# EAGLE design untitled (EAGLE 8.4.3)
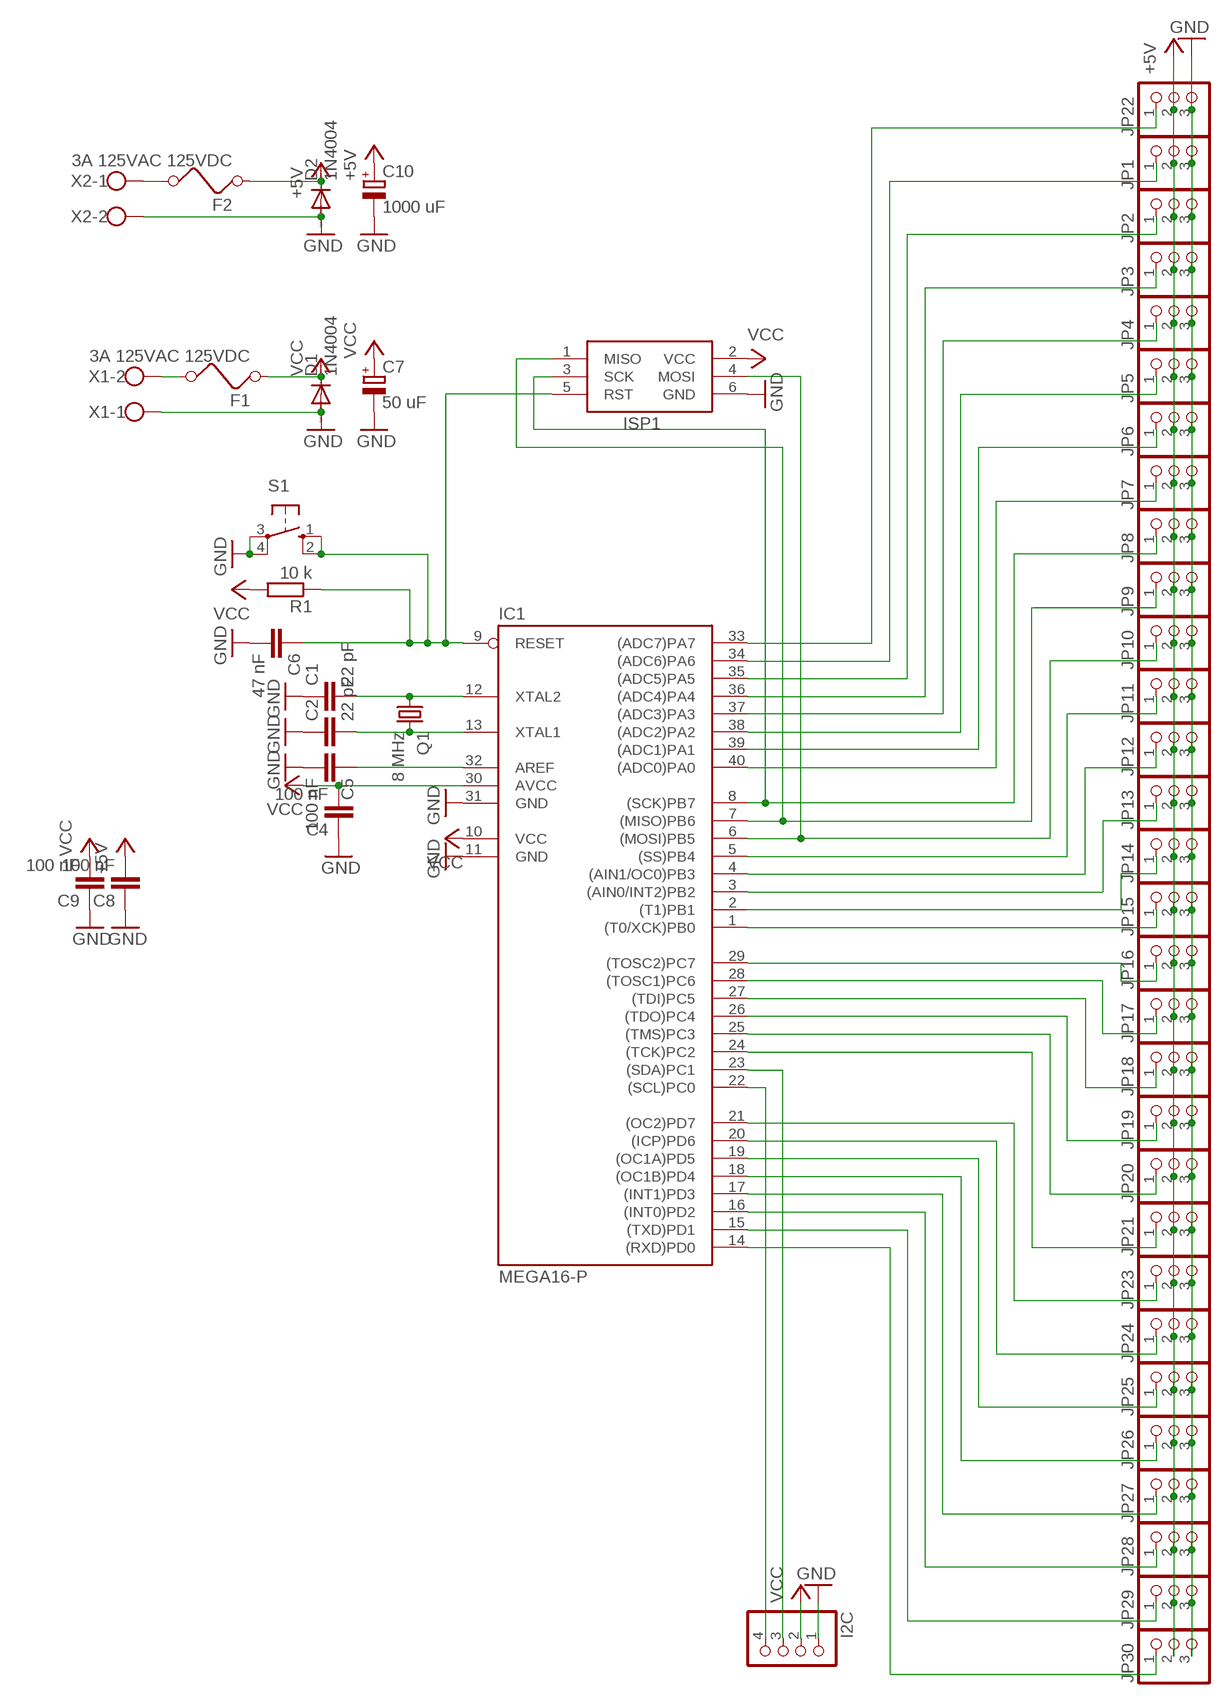
[diagram p0: schematic, sheet 1]

## Parts
C1  22 pF  C-EUC0805  [C0805]
C2  22 pF  C-EUC0805  [C0805]
C4  100 nF  C-EUC0805  [C0805]
C5  100 nF  C-EUC0805  [C0805]
C6  47 nF  C-EUC0805  [C0805]
C7  50 uF  CPOL-EUE2-5  [E2-5]
C8  100 nF  C-EUC0805  [C0805]
C9  100 nF  C-EUC0805  [C0805]
C10  1000 uF  CPOL-EUE2-5  [E2-5]
D1  1N4004  DIODE-DO214AC  [DO214AC]
D2  1N4004  DIODE-DO214AC  [DO214AC]
F1  3A 125VAC 125VDC  FUSE  [FUSE]
F2  3A 125VAC 125VDC  FUSE  [FUSE]
I2C  PINHD-1X4  [1X04]
IC1  MEGA16-P  [DIL40]
ISP1  AVRISP-6  [AVRISP]
JP1  PINHD-1X3  [1X03]
JP2  PINHD-1X3  [1X03]
JP3  PINHD-1X3  [1X03]
JP4  PINHD-1X3  [1X03]
JP5  PINHD-1X3  [1X03]
JP6  PINHD-1X3  [1X03]
JP7  PINHD-1X3  [1X03]
JP8  PINHD-1X3  [1X03]
JP9  PINHD-1X3  [1X03]
JP10  PINHD-1X3  [1X03]
JP11  PINHD-1X3  [1X03]
JP12  PINHD-1X3  [1X03]
JP13  PINHD-1X3  [1X03]
JP14  PINHD-1X3  [1X03]
JP15  PINHD-1X3  [1X03]
JP16  PINHD-1X3  [1X03]
JP17  PINHD-1X3  [1X03]
JP18  PINHD-1X3  [1X03]
JP19  PINHD-1X3  [1X03]
JP20  PINHD-1X3  [1X03]
JP21  PINHD-1X3  [1X03]
JP22  PINHD-1X3  [1X03]
JP23  PINHD-1X3  [1X03]
JP24  PINHD-1X3  [1X03]
JP25  PINHD-1X3  [1X03]
JP26  PINHD-1X3  [1X03]
JP27  PINHD-1X3  [1X03]
JP28  PINHD-1X3  [1X03]
JP29  PINHD-1X3  [1X03]
JP30  PINHD-1X3  [1X03]
Q1  8 MHz  CRYSTALHC49S  [HC49/S]
R1  10 k  R-EU_R0805  [R0805]
S1  10-XX  [B3F-10XX]
X1  W237-102  [W237-102]
X2  W237-102  [W237-102]

## Nets
+5V: C8.2 C10.+ D2.C F2.1 JP1.2 JP2.2 JP3.2 JP4.2 JP5.2 JP6.2 JP7.2 JP8.2 JP9.2 JP10.2 JP11.2 JP12.2 JP13.2 JP14.2 JP15.2 JP16.2 JP17.2 JP18.2 JP19.2 JP20.2 JP21.2 JP22.2 JP23.2 JP24.2 JP25.2 JP26.2 JP27.2 JP28.2 JP29.2 JP30.2
GND: C1.1 C2.1 C4.1 C5.2 C6.2 C7.- C8.1 C9.1 C10.- D1.A D2.A I2C.1 IC1.11(GND) IC1.31(GND) ISP1.6(GND) JP1.3 JP2.3 JP3.3 JP4.3 JP5.3 JP6.3 JP7.3 JP8.3 JP9.3 JP10.3 JP11.3 JP12.3 JP13.3 JP14.3 JP15.3 JP16.3 JP17.3 JP18.3 JP19.3 JP20.3 JP21.3 JP22.3 JP23.3 JP24.3 JP25.3 JP26.3 JP27.3 JP28.3 JP29.3 JP30.3 S1.3(P) S1.4(P1) X1.1 X2.2
N$1: C1.2 IC1.12(XTAL2) Q1.1
N$2: C2.2 IC1.13(XTAL1) Q1.2
N$3: C5.1 IC1.32(AREF)
N$4: F1.2 X1.2
N$5: IC1.8((SCK)PB7) ISP1.3(SCK) JP8.1
N$6: IC1.6((MOSI)PB5) ISP1.4(MOSI) JP10.1
N$7: C6.1 IC1.9(RESET) ISP1.5(RST) R1.1 S1.1(S) S1.2(S1)
N$8: IC1.1((T0/XCK)PB0) JP15.1
N$9: I2C.4 IC1.22((SCL)PC0)
N$10: F2.2 X2.1
N$13: IC1.36((ADC4)PA4) JP3.1
N$15: IC1.33((ADC7)PA7) JP22.1
N$16: IC1.39((ADC1)PA1) JP6.1
N$17: I2C.3 IC1.23((SDA)PC1)
N$21: IC1.28((TOSC1)PC6) JP17.1
N$22: IC1.7((MISO)PB6) ISP1.1(MISO) JP9.1
N$23: IC1.27((TDI)PC5) JP18.1
N$24: IC1.40((ADC0)PA0) JP7.1
N$25: IC1.4((AIN1/OC0)PB3) JP12.1
N$27: IC1.29((TOSC2)PC7) JP16.1
N$29: IC1.2((T1)PB1) JP14.1
N$30: IC1.3((AIN0/INT2)PB2) JP13.1
N$31: IC1.37((ADC3)PA3) JP4.1
N$32: IC1.5((SS)PB4) JP11.1
N$36: IC1.38((ADC2)PA2) JP5.1
N$39: IC1.35((ADC5)PA5) JP2.1
N$40: IC1.34((ADC6)PA6) JP1.1
N$41: IC1.26((TDO)PC4) JP19.1
N$42: IC1.25((TMS)PC3) JP20.1
N$43: IC1.24((TCK)PC2) JP21.1
N$44: IC1.21((OC2)PD7) JP23.1
N$45: IC1.20((ICP)PD6) JP24.1
N$46: IC1.19((OC1A)PD5) JP25.1
N$47: IC1.18((OC1B)PD4) JP26.1
N$48: IC1.17((INT1)PD3) JP27.1
N$49: IC1.16((INT0)PD2) JP28.1
N$56: IC1.15((TXD)PD1) JP29.1
N$57: IC1.14((RXD)PD0) JP30.1
VCC: C4.2 C7.+ C9.2 D1.C F1.1 I2C.2 IC1.10(VCC) IC1.30(AVCC) ISP1.2(VCC) R1.2

## Library data of the parts
C1 C2 C4-C6 C8 C9 = rcl:C-EU: CAPACITOR, European symbol
C7 C10 = rcl:CPOL-EU: POLARIZED CAPACITOR, European symbol
D1 D2 = diode:DIODE-: DIODE
F1 F2 = special:FUSE: FUSE 5 x 20 mm
I2C = pinhead:PINHD-1X4: PIN HEADER
IC1 = atmel:MEGA16-P: MICROCONTROLLER 16 Kbytes FLASH 1 kbytes SRAM 512 bytes EEPROM USART 8-channel 10 bit ADC Source: avr.lbr; MPN: ATMEGA16-16PU; OC_FARNELL: 9171142; OC_NEWARK: 01M6885
ISP1 = adafruit:AVRISP: AVR ISP HEADER Standard 6 pin header for AVR programming
JP1-JP30 = pinhead:PINHD-1X3: PIN HEADER
Q1 = adafruit:CRYSTAL: CRYSTAL; OC_FARNELL: 1667008; OC_NEWARK: unknown
R1 = rcl:R-EU_: RESISTOR, European symbol
S1 = switch-omron:10-XX: OMRON SWITCH; MPN: B3F-1000; OC_FARNELL: 176432; OC_NEWARK: 36M3542
X1 X2 = con-wago-500:W237-102: WAGO SCREW CLAMP; MPN: 237-102; OC_FARNELL: unknown; OC_NEWARK: 70K9898

## Board
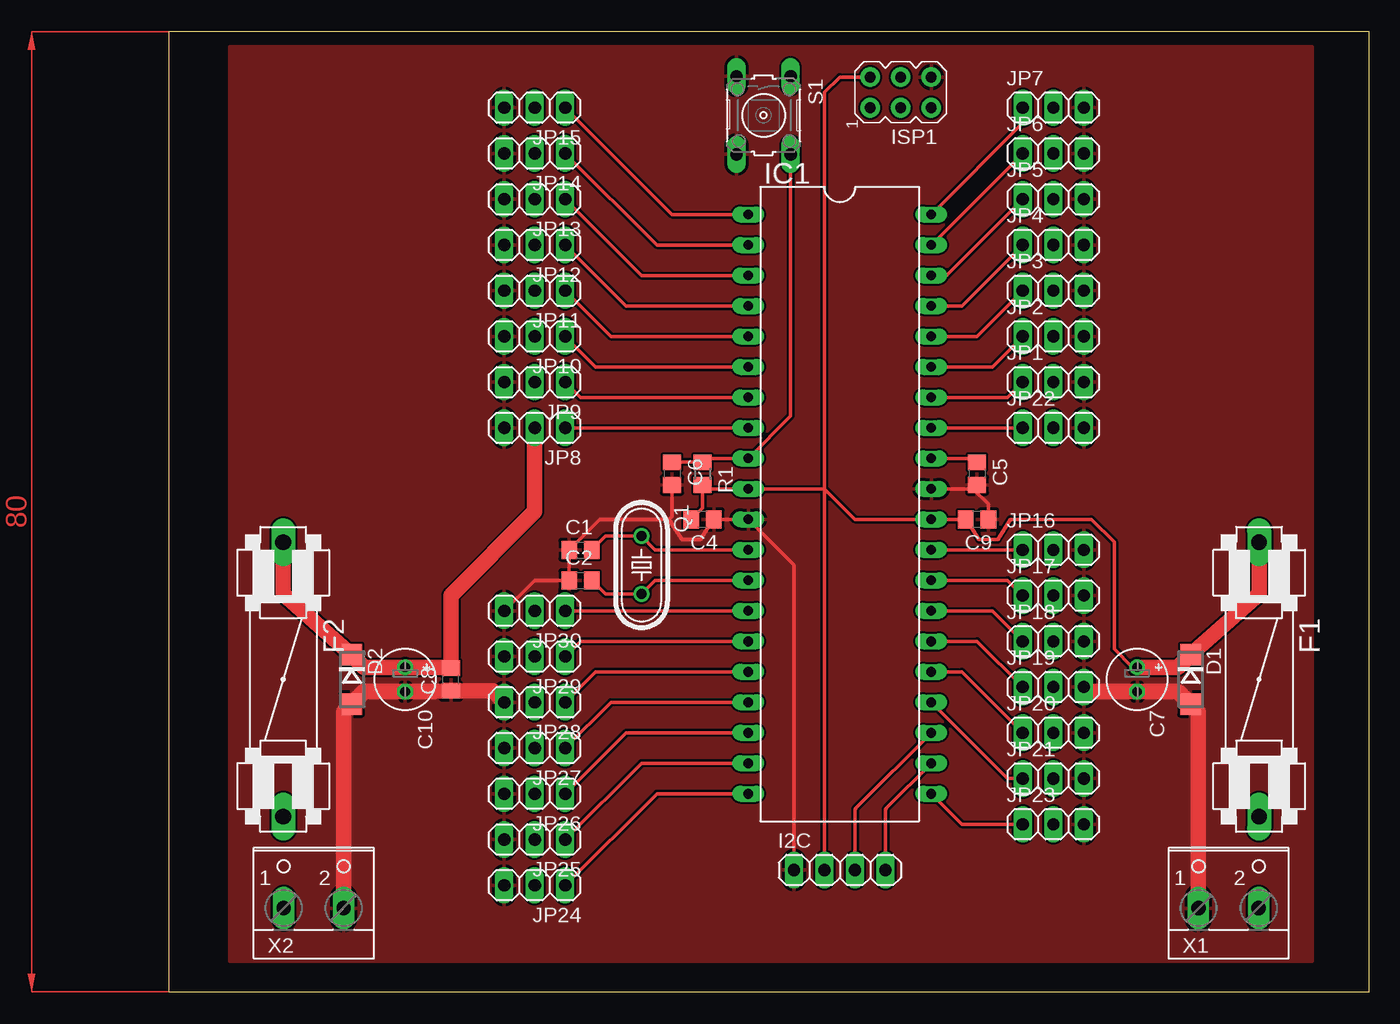
[diagram p1: board, top side]
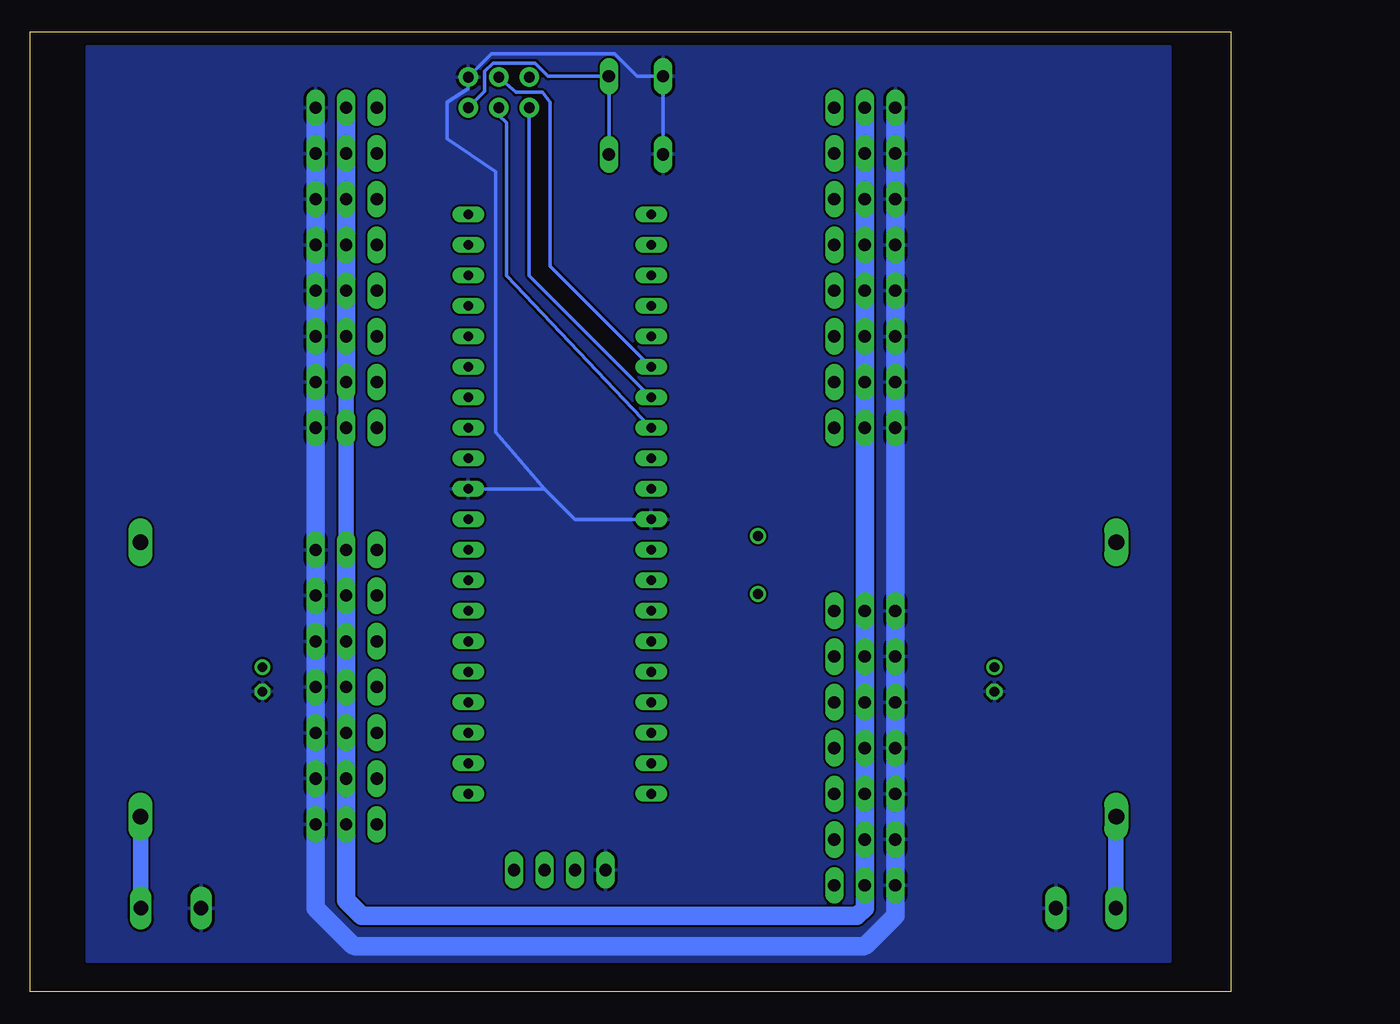
[diagram p2: board, bottom side, seen from below]

Size 100 x 80 mm. Coordinates in mm from the lower left corner, seen from the top.
Outline: 0,0 100,0 100,80 0,80 0,0
Copper layers (1*16): Top 0.035mm / dielectric 1.5mm / Bottom 0.035mm
Design rules "default *": minimum track width 12mil, minimum drill 0.3mm, track to track 7mil, track to pad 7mil, pad to pad 7mil, via to via 7mil, smd to smd 7mil, copper to edge 40mil, drill to drill 6mil, minimum pad ring 10mil, minimum via ring 8mil, stop-mask expansion 4mil, vias tented up to drill 0mil, thermal gap 10mil

### Footprints (pad centres in the part's own frame; a part is rotated, then mirrored left to right if it is on the bottom)
C0805 = smd 1.3 x 1.5: 1 -0.95,0; 2 0.95,0
E2-5 = drill 0.813 pad 1.27: + -1.016,0 | drill 0.813 pad 1.27 octagon: - 1.016,0
DO214AC = smd 1.8 x 1.7: A 2.05,0; C -2.05,0
FUSE = drill 1.321 long: 1 -11.43,0; 2 11.43,0
1X04 = drill 1.016 long: 1 -3.81,0; 2 -1.27,0; 3 1.27,0; 4 3.81,0
DIL40 = drill 0.813 long: 1 -24.13,-7.62; 2 -21.59,-7.62; 3 -19.05,-7.62; 4 -16.51,-7.62; 5 -13.97,-7.62; 6 -11.43,-7.62; 7 -8.89,-7.62; 8 -6.35,-7.62; 9 -3.81,-7.62; 10 -1.27,-7.62; 11 1.27,-7.62; 12 3.81,-7.62; 13 6.35,-7.62; 14 8.89,-7.62; 15 11.43,-7.62; 16 13.97,-7.62; 17 16.51,-7.62; 18 19.05,-7.62; 19 21.59,-7.62; 20 24.13,-7.62; 21 24.13,7.62; 22 21.59,7.62; 23 19.05,7.62; 24 16.51,7.62; 25 13.97,7.62; 26 11.43,7.62; 27 8.89,7.62; 28 6.35,7.62; 29 3.81,7.62; 30 1.27,7.62; 31 -1.27,7.62; 32 -3.81,7.62; 33 -6.35,7.62; 34 -8.89,7.62; 35 -11.43,7.62; 36 -13.97,7.62; 37 -16.51,7.62; 38 -19.05,7.62; 39 -21.59,7.62; 40 -24.13,7.62
AVRISP = drill 0.9 pad 1.626: 1 -1.27,2.54; 2 1.27,2.54; 3 -1.27,0; 4 1.27,0; 5 -1.27,-2.54; 6 1.27,-2.54
1X03 = drill 1.016 long: 1 -2.54,0; 2 0,0; 3 2.54,0
HC49/S = drill 0.813: 1 -2.413,0; 2 2.413,0
R0805 = smd 1.3 x 1.5: 1 -0.95,0; 2 0.95,0
B3F-10XX = drill 1.016 long: 1 -3.251,2.261; 2 3.251,2.261; 3 -3.251,-2.261; 4 3.251,-2.261
W237-102 = drill 1.194 long: 1 -2.5,-1.27; 2 2.5,-1.27

### Placement (x,y rotation side)
C1  34.29,36.83 0 top
C2  34.29,34.29 0 top
C4  44.45,39.37 180 top
C5  67.31,43.18 270 top
C6  41.91,43.18 270 top
C7  80.64,26.04 270 top
C8  23.5,26.04 90 top
C9  67.31,39.37 180 top
C10  19.68,26.04 270 top
D1  85.09,26.04 270 top
D2  15.24,26.04 270 top
F1  90.81,26.04 270 top
F2  9.53,26.04 270 top
I2C  55.88,10.16 0 top
IC1  55.88,40.64 270 top
ISP1  60.96,74.93 90 top
JP1  73.66,50.8 0 top
JP2  73.66,54.61 0 top
JP3  73.66,58.42 0 top
JP4  73.66,62.23 0 top
JP5  73.66,66.04 0 top
JP6  73.66,69.85 0 top
JP7  73.66,73.66 0 top
JP8  30.48,46.99 180 top
JP9  30.48,50.8 180 top
JP10  30.48,54.61 180 top
JP11  30.48,58.42 180 top
JP12  30.48,62.23 180 top
JP13  30.48,66.04 180 top
JP14  30.48,69.85 180 top
JP15  30.48,73.66 180 top
JP16  73.66,36.83 0 top
JP17  73.66,33.02 0 top
JP18  73.66,29.21 0 top
JP19  73.66,25.4 0 top
JP20  73.66,21.59 0 top
JP21  73.66,17.78 0 top
JP22  73.66,46.99 0 top
JP23  73.66,13.97 0 top
JP24  30.48,8.89 180 top
JP25  30.48,12.7 180 top
JP26  30.48,16.51 180 top
JP27  30.48,20.32 180 top
JP28  30.48,24.13 180 top
JP29  30.48,27.94 180 top
JP30  30.48,31.75 180 top
Q1  39.37,35.56 270 top
R1  44.45,43.18 270 top
S1  49.53,73.03 270 top
X1  88.27,8.26 0 top
X2  12.06,8.26 0 top

### Tracks (layer width: path | path; a pad name or v marks a point on that pad's centre or on a via)
+5V
  Top 1.27: F2.1 9.53,33.16 D2.C 16.27,27.05 C10.+ 22.79,27.05 C8.2 23.5,33.02 30.48,40.01 JP8.2
  Bottom 1.27: JP1.2 JP22.2 JP16.2
  Bottom 1.524: JP7.2 JP6.2 JP5.2 JP4.2 JP3.2 JP2.2 JP1.2 | JP16.2 JP17.2 JP18.2 JP19.2 JP20.2 JP21.2 JP23.2 73.66,7.62 72.39,6.35 31.11,6.35 30.48,6.99 JP24.2 JP25.2 JP26.2 JP27.2 JP28.2 JP29.2 JP30.2 JP8.2 JP9.2 JP10.2 JP11.2 JP12.2 JP13.2 JP14.2 JP15.2
GND
  Top 0.305: IC1.31 66.99,41.91 | 66.99,41.91 C5.2 | 41.67,39.37 35.88,39.37 C1.1 C2.1 30.61,34.29 arc45 30.39,34.2 JP30.3 | 41.67,39.37 42.72,37.68 44.28,37.68 45.33,39.37 C4.1 IC1.11 52.07,35.56 I2C.1 | C6.2 41.91,39.61 41.67,39.37 | 66.99,41.91 68.26,40.64 C9.1
  Top 1.27: JP28.3 26.99,25.09 C8.1 22.16,25.02 C10.- 16.27,25.02 D2.A 14.56,23.31 X2.2 | X1.1 85.77,23.31 D1.A 84.06,25.02 C7.- 76.58,25.02 JP19.3
  Bottom 0.305: S1.4 S1.3 49.45,76.28 51.33,78.16 61.54,78.16 ISP1.6 63.5,75.24 65.25,74.12 65.25,71.09 61.24,68.34 61.24,46.63 57.15,41.91 | IC1.11 54.61,39.37 57.15,41.91 | 57.15,41.91 IC1.31
  Bottom 1.27: 30.39,3.9 arc45 30.61,3.81 | 72.9,3.81 arc45 73.11,3.9
  Bottom 1.524: JP7.3 JP6.3 JP5.3 JP4.3 JP3.3 JP2.3 JP1.3 JP22.3 JP16.3 JP17.3 JP18.3 JP19.3 JP20.3 JP21.3 JP23.3 76.2,6.99 73.11,3.9 | JP15.3 JP14.3 JP13.3 JP12.3 JP11.3 JP10.3 JP9.3 JP8.3 JP30.3 JP29.3 JP28.3 JP27.3 JP26.3 JP25.3 JP24.3 27.94,6.35 30.39,3.9 | 30.61,3.81 72.9,3.81
  pour Top: 6.35,2.54 95.25,2.54 95.25,78.74 5.08,78.74 5.08,2.54
  pour Bottom: 5.08,78.74 5.08,2.54 95.25,2.54 95.25,78.74
N$1
  Top 0.305: IC1.12 40.51,36.83 Q1.1 36.38,37.97 C1.2
N$2
  Top 0.305: IC1.13 40.51,34.29 Q1.2 36.38,33.15 C2.2
N$3
  Top 0.305: IC1.32 66.99,44.45 C5.1
N$4
  Bottom 1.27: F1.2 90.77,14.56 X1.2
N$5
  Top 0.305: JP8.1 IC1.8
  Bottom 0.305: IC1.8 60.33,59.69 60.33,72.39 60.96,73.03 ISP1.3
N$6
  Top 0.305: JP10.1 35.56,52.07 IC1.6
  Bottom 0.305: IC1.6 56.67,60.48 56.67,74.12 57.32,74.94 59.54,74.94 ISP1.4
N$7
  Top 0.305: C6.1 R1.1 44.77,44.45 IC1.9 51.79,47.98 S1.2
  Bottom 0.305: S1.2 S1.1 56.84,76.28 57.94,77.37 61.44,77.37 62.13,76.68 62.13,75.03 ISP1.5
N$8
  Top 0.305: JP15.1 41.91,64.77 IC1.1
N$9
  Top 0.305: IC1.22 59.78,15.33 arc45 59.69,15.11 I2C.4
N$10
  Bottom 1.27: F2.2 9.56,14.56 X2.1
N$13
  Top 0.305: IC1.36 67.31,54.61 JP3.1
N$15
  Top 0.305: IC1.33 JP22.1
N$16
  Top 0.305: IC1.39 JP6.1
N$17
  Top 0.305: IC1.23 57.24,15.33 arc45 57.15,15.11 I2C.3
N$21
  Top 0.305: IC1.28 69.85,34.29 JP17.1
N$22
  Top 0.305: JP9.1 34.29,49.53 IC1.7
  Bottom 0.305: IC1.7 58.42,59.69 ISP1.1
N$23
  Top 0.305: IC1.27 68.58,31.75 JP18.1
N$24
  Top 0.305: IC1.40 71.12,72.39 JP7.1
N$25
  Top 0.305: JP12.1 38.1,57.15 IC1.4
N$27
  Top 0.305: IC1.29 JP16.1
N$29
  Top 0.305: JP14.1 40.64,62.23 IC1.2
N$30
  Top 0.305: JP13.1 39.37,59.69 IC1.3
N$31
  Top 0.305: IC1.37 66.04,57.15 JP4.1
N$32
  Top 0.305: JP11.1 36.83,54.61 IC1.5
N$36
  Top 0.305: IC1.38 64.77,59.69 JP5.1
N$39
  Top 0.305: IC1.35 68.58,52.07 JP2.1
N$40
  Top 0.305: IC1.34 69.85,49.53 JP1.1
N$41
  Top 0.305: IC1.26 67.31,29.21 JP19.1
N$42
  Top 0.305: IC1.25 66.04,26.67 JP20.1
N$43
  Top 0.305: IC1.24 69.85,17.78 JP21.1
N$44
  Top 0.305: IC1.21 66.04,13.97 JP23.1
N$45
  Top 0.305: IC1.20 40.64,16.51 JP24.1
N$46
  Top 0.305: IC1.19 39.37,19.05 JP25.1
N$47
  Top 0.305: IC1.18 38.1,21.59 JP26.1
N$48
  Top 0.305: IC1.17 36.83,24.13 JP27.1
N$49
  Top 0.305: IC1.16 35.56,26.67 JP28.1
N$56
  Top 0.305: IC1.15 34.29,29.21 JP29.1
N$57
  Top 0.305: IC1.14 JP30.1
VCC
  Top 0.305: C4.2 44.45,40.32 R1.2 44.77,41.91 IC1.10 54.61,41.91 | C7.+ 80.26,27.05 78.74,28.57 78.74,37.47 76.83,39.37 70.09,39.37 69.04,37.68 67.48,37.68 66.43,39.37 C9.2 IC1.30 57.15,39.37 54.61,41.91 | I2C.2 54.61,41.91 | 54.61,41.91 54.61,74.93 55.88,76.2 ISP1.2
  Top 1.27: C7.+ 84.06,27.05 D1.C 90.81,33.16 F1.1
(copper drawn outside any net)
  shapes: Top area x1